# EAGLE design pic-lcd-std (EAGLE 6.1)
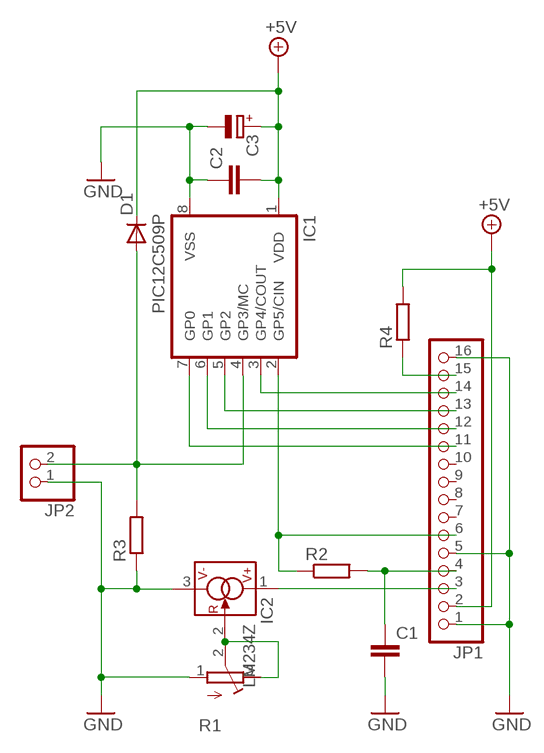
[diagram p0: schematic, sheet 1]

## Parts
C1  C-EU025-025X050  [C025-025X050]
C2  C-EU025-025X050  [C025-025X050]
C3  CPOL-EUTT2D5L  [TT2D5L]
D1  DIODE-DO34-7  [DO34-7]
IC1  PIC12C509P  [DIL8]
IC2  LM234Z  [TO92]
JP1  PINHD-1X16  [1X16]
JP2  PINHD-1X2/90  [1X02/90]
R1  R-TRIMM3296P  [RTRIM3296P]
R2  R-EU_0204/7  [0204/7]
R3  R-EU_0204/7  [0204/7]
R4  R-EU_0204/7  [0204/7]

## Nets
+5V: C2.2 C3.+ D1.C IC1.1(VDD) JP1.2 R4.2
GND: C1.2 C2.1 C3.- IC1.8(VSS) IC2.3(V-) JP1.1 JP1.5 JP1.16 JP2.1 R1.1(A) R3.1
N$1: IC2.1(V+) JP1.3
N$2: C1.1 JP1.4 R2.2
N$3: D1.A IC1.4(GP3/MC) JP2.2 R3.2
N$4: IC1.2(GP5/CIN) JP1.6 R2.1
N$5: IC2.2(R) R1.2(S) R1.3(E)
N$9: IC1.7(GP0) JP1.11
N$10: IC1.6(GP1) JP1.12
N$11: IC1.5(GP2) JP1.13
N$12: IC1.3(GP4/COUT) JP1.14
N$13: JP1.15 R4.1
Unconnected: JP1.7 JP1.8 JP1.9 JP1.10

## Library data of the parts
C1 C2 = rcl:C-EU: CAPACITOR, European symbol
C3 = rcl:CPOL-EU: POLARIZED CAPACITOR, European symbol
D1 = diode:DIODE-: DIODE
IC1 = microchip:PIC12C*?: MICROCONTROLLER; MF: MICROCHIP; MPN: PIC12C509-04/P; OC_FARNELL: 9758810; OC_NEWARK: 54K2820
IC2 = linear:LM*34: 3-Terminal Adjustable Current Sources Source: www.national.com/pf/LM/LM334.html | LM134.pdf
JP1 = pinhead:PINHD-1X16: PIN HEADER
JP2 = pinhead:PINHD-1X2: PIN HEADER
R1 = rcl:R-TRIMM: Trimm resistor
R2-R4 = rcl:R-EU_: RESISTOR, European symbol

## Board
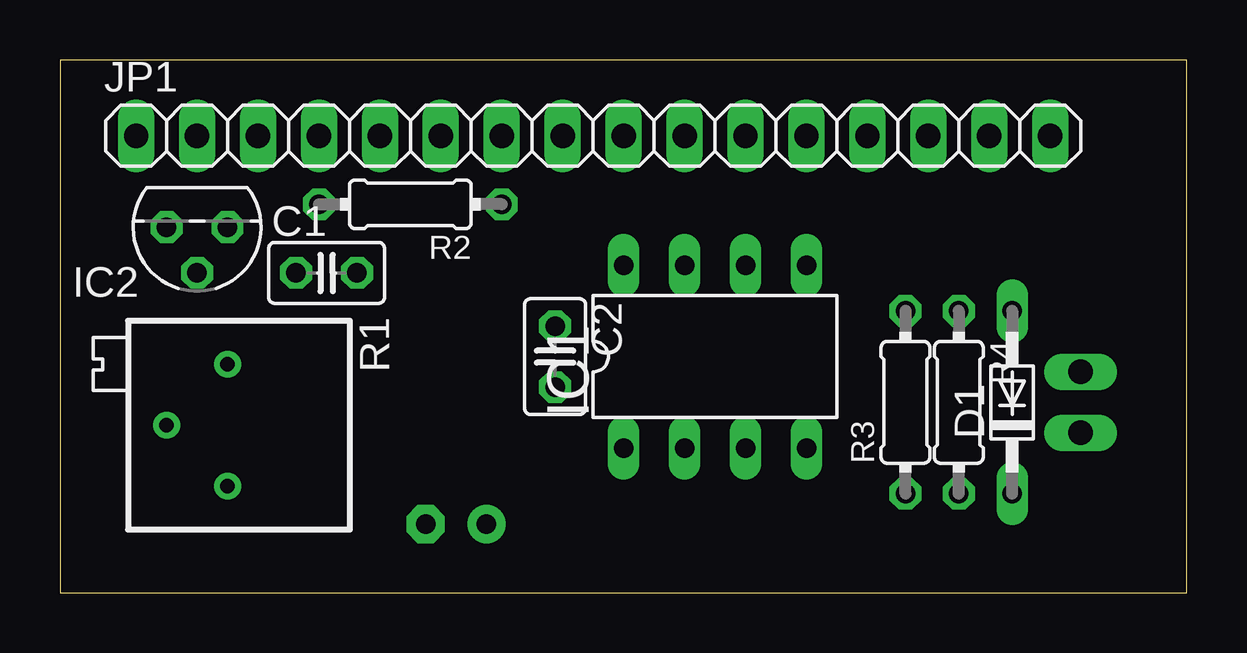
[diagram p1: board, top side]
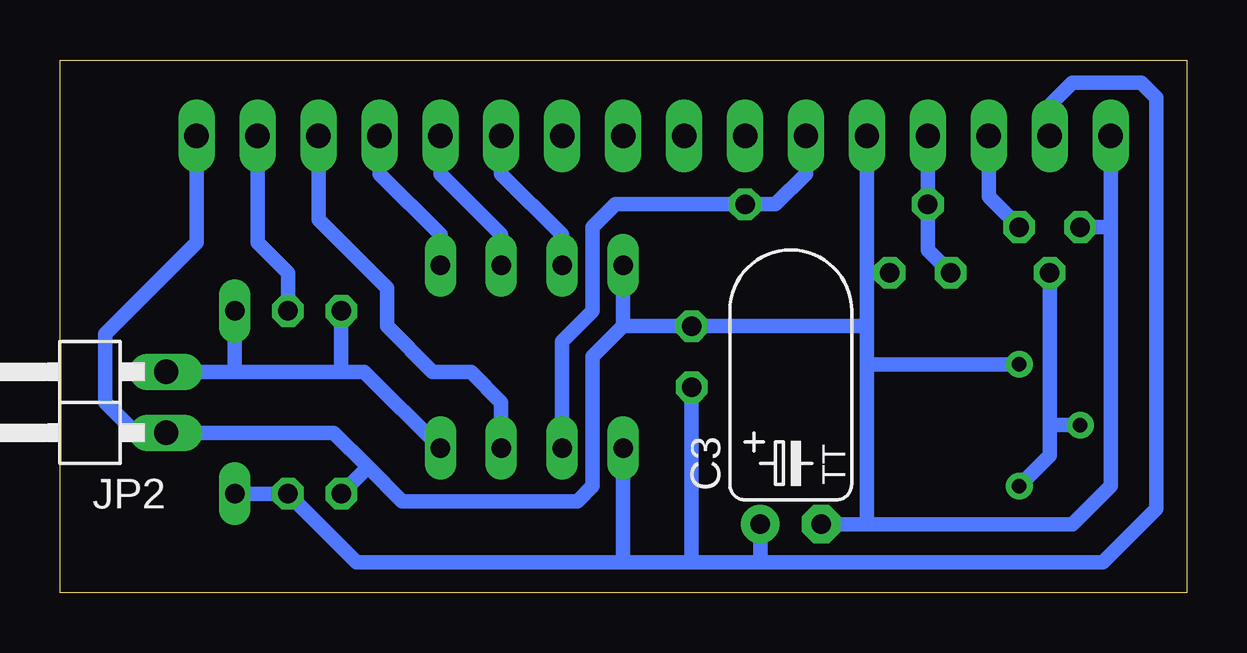
[diagram p2: board, bottom side, seen from below]

Size 46.97 x 22.21 mm. Coordinates in mm from the lower left corner, seen from the top.
Outline: 0,0 46.97,0 46.97,22.21 0,22.21 0,0
Copper layers (1*16): Top 0.035mm / dielectric 1.5mm / Bottom 0.035mm
Design rules: minimum track width 10mil, minimum drill 24mil, track to track 12mil, track to pad 12mil, pad to pad 12mil, via to via 12mil, smd to smd 10mil, copper to edge 12mil, drill to drill 12mil, minimum pad ring 10mil, minimum via ring 10mil, stop-mask expansion 4mil, vias tented up to drill 0mil, thermal gap 12mil

### Footprints (pad centres in the part's own frame; a part is rotated, then mirrored left to right if it is on the bottom)
C025-025X050 = drill 0.813 octagon: 1 -1.27,0; 2 1.27,0
TT2D5L = drill 0.813 pad 1.6: + -1.27,0 | drill 0.813 pad 1.6 octagon: - 1.27,0
DO34-7 = drill 0.813 long: A 3.81,0; C -3.81,0
DIL8 = drill 0.813 long: 1 -3.81,-3.81; 2 -1.27,-3.81; 3 1.27,-3.81; 4 3.81,-3.81; 5 3.81,3.81; 6 1.27,3.81; 7 -1.27,3.81; 8 -3.81,3.81
TO92 = drill 0.813 octagon: 1 -1.27,0; 2 0,1.905; 3 1.27,0
1X16 = drill 1.016 long: 1 -19.05,0; 2 -16.51,0; 3 -13.97,0; 4 -11.43,0; 5 -8.89,0; 6 -6.35,0; 7 -3.81,0; 8 -1.27,0; 9 1.27,0; 10 3.81,0; 11 6.35,0; 12 8.89,0; 13 11.43,0; 14 13.97,0; 15 16.51,0; 16 19.05,0
1X02/90 = drill 1.016 long: 1 -1.27,-3.81; 2 1.27,-3.81
RTRIM3296P = drill 0.61: 1 0,-2.54; 2 2.54,0; 3 0,2.54
0204/7 = drill 0.813 octagon: 1 -3.81,0; 2 3.81,0

### Placement (x,y rotation side)
C1  11.11,13.34 0 top
C2  20.64,9.84 270 top
C3  16.51,2.86 0 bottom
D1  39.69,7.94 90 top
IC1  27.31,9.84 0 top
IC2  5.71,15.24 180 top
JP1  22.22,19.05 0 top
JP2  46.36,7.94 90 bottom
R1  6.99,6.98 180 top
R2  14.61,16.19 180 top
R3  35.24,7.94 90 top
R4  37.47,7.94 270 top

### Tracks (layer width: path | path; a pad name or v marks a point on that pad's centre or on a via)
+5V
  Bottom 0.61: JP1.2 5.71,20.32 4.76,21.27 1.91,21.27 1.27,20.64 1.27,3.49 3.49,1.27 17.78,1.27 | 17.78,1.27 20.64,1.27 | 20.64,1.27 23.5,1.27 | 23.5,1.27 34.61,1.27 R4.2 D1.C | IC1.1 23.5,1.27 | C3.+ 17.78,1.27 | C2.2 20.64,1.27
GND
  Bottom 0.61: JP1.1 3.18,15.24 | 3.18,15.24 3.18,4.45 4.76,2.86 13.34,2.86 | IC2.3 3.18,15.24 | 13.34,2.86 C3.- 14.29,2.86 | JP1.5 13.34,13.34 | 13.34,13.34 13.34,11.11 | 13.34,11.11 13.34,9.52 | 13.34,11.11 C2.1 23.5,11.11 | R1.1 13.34,9.52 | 13.34,9.52 13.34,2.86 | 34.13,5.24 32.7,3.81 25.4,3.81 24.77,4.45 24.77,9.84 23.5,11.11 | 34.13,5.24 35.56,6.67 JP2.1 43.81,6.67 45.08,7.94 45.08,10.79 41.28,14.61 JP1.16 | R3.1 34.13,5.24 | IC1.8 23.5,11.11 | C1.2 13.34,13.34
N$1
  Bottom 0.61: IC2.1 8.26,16.51 JP1.3
N$2
  Bottom 0.61: JP1.4 R2.2 10.8,14.29 C1.1
N$3
  Bottom 0.61: 39.69,9.21 35.24,9.21 | 35.24,9.21 34.29,9.21 IC1.4 | R3.2 35.24,9.21 | D1.A 39.69,9.21 | 39.69,9.21 JP2.2
N$4
  Bottom 0.61: JP1.6 15.88,17.46 17.14,16.19 R2.1 23.81,16.19 24.77,15.24 24.77,11.75 26.04,10.48 IC1.2
N$5
  Bottom 0.61: IC2.2 5.71,6.98 | 5.71,6.98 5.71,5.71 R1.3 | R1.2 5.71,6.98
N$9
  Bottom 0.61: IC1.7 26.04,14.92 28.57,17.46 JP1.11
N$10
  Bottom 0.61: IC1.6 28.57,14.92 31.11,17.46 JP1.12
N$11
  Bottom 0.61: IC1.5 31.11,14.92 33.66,17.46 JP1.13
N$12
  Bottom 0.61: JP1.14 36.2,15.56 33.34,12.7 33.34,11.11 31.43,9.21 29.85,9.21 28.57,7.94 IC1.3
N$13
  Bottom 0.61: R4.1 37.47,13.34 38.73,14.61 JP1.15